# Altium schematic sheet TitlePage.SchDoc: Renesas Public Template
size Tabloid; Author: M. Merrill; Company Name: Renesas Electronics America; Organization: Renesas Electronics; Address1: 915 Murphy Ranch Road; Address2: Milpitas, CA  95035; DocumentNumber: 1; Revision: 01; SheetNumber: 1; SheetTotal: 2; CompanyURL: www.renesas.com; PageSetup: Record=PageOptions|CenterHorizontal=True|CenterVertical=True|PrintScale=1.00|XCorrection=1.00|YCorrection=1.00|PrintKind=1|BorderSize=5000000|LeftOffset=0|BottomOffset=0|Orientation=2|PaperLength=1000|PaperWidth=1000|Scale=100|PaperSource=7|PrintQuality=-4|MediaType=1|DitherType=10|PaperKind=A5 148x210mm|PrintScaleMode=1
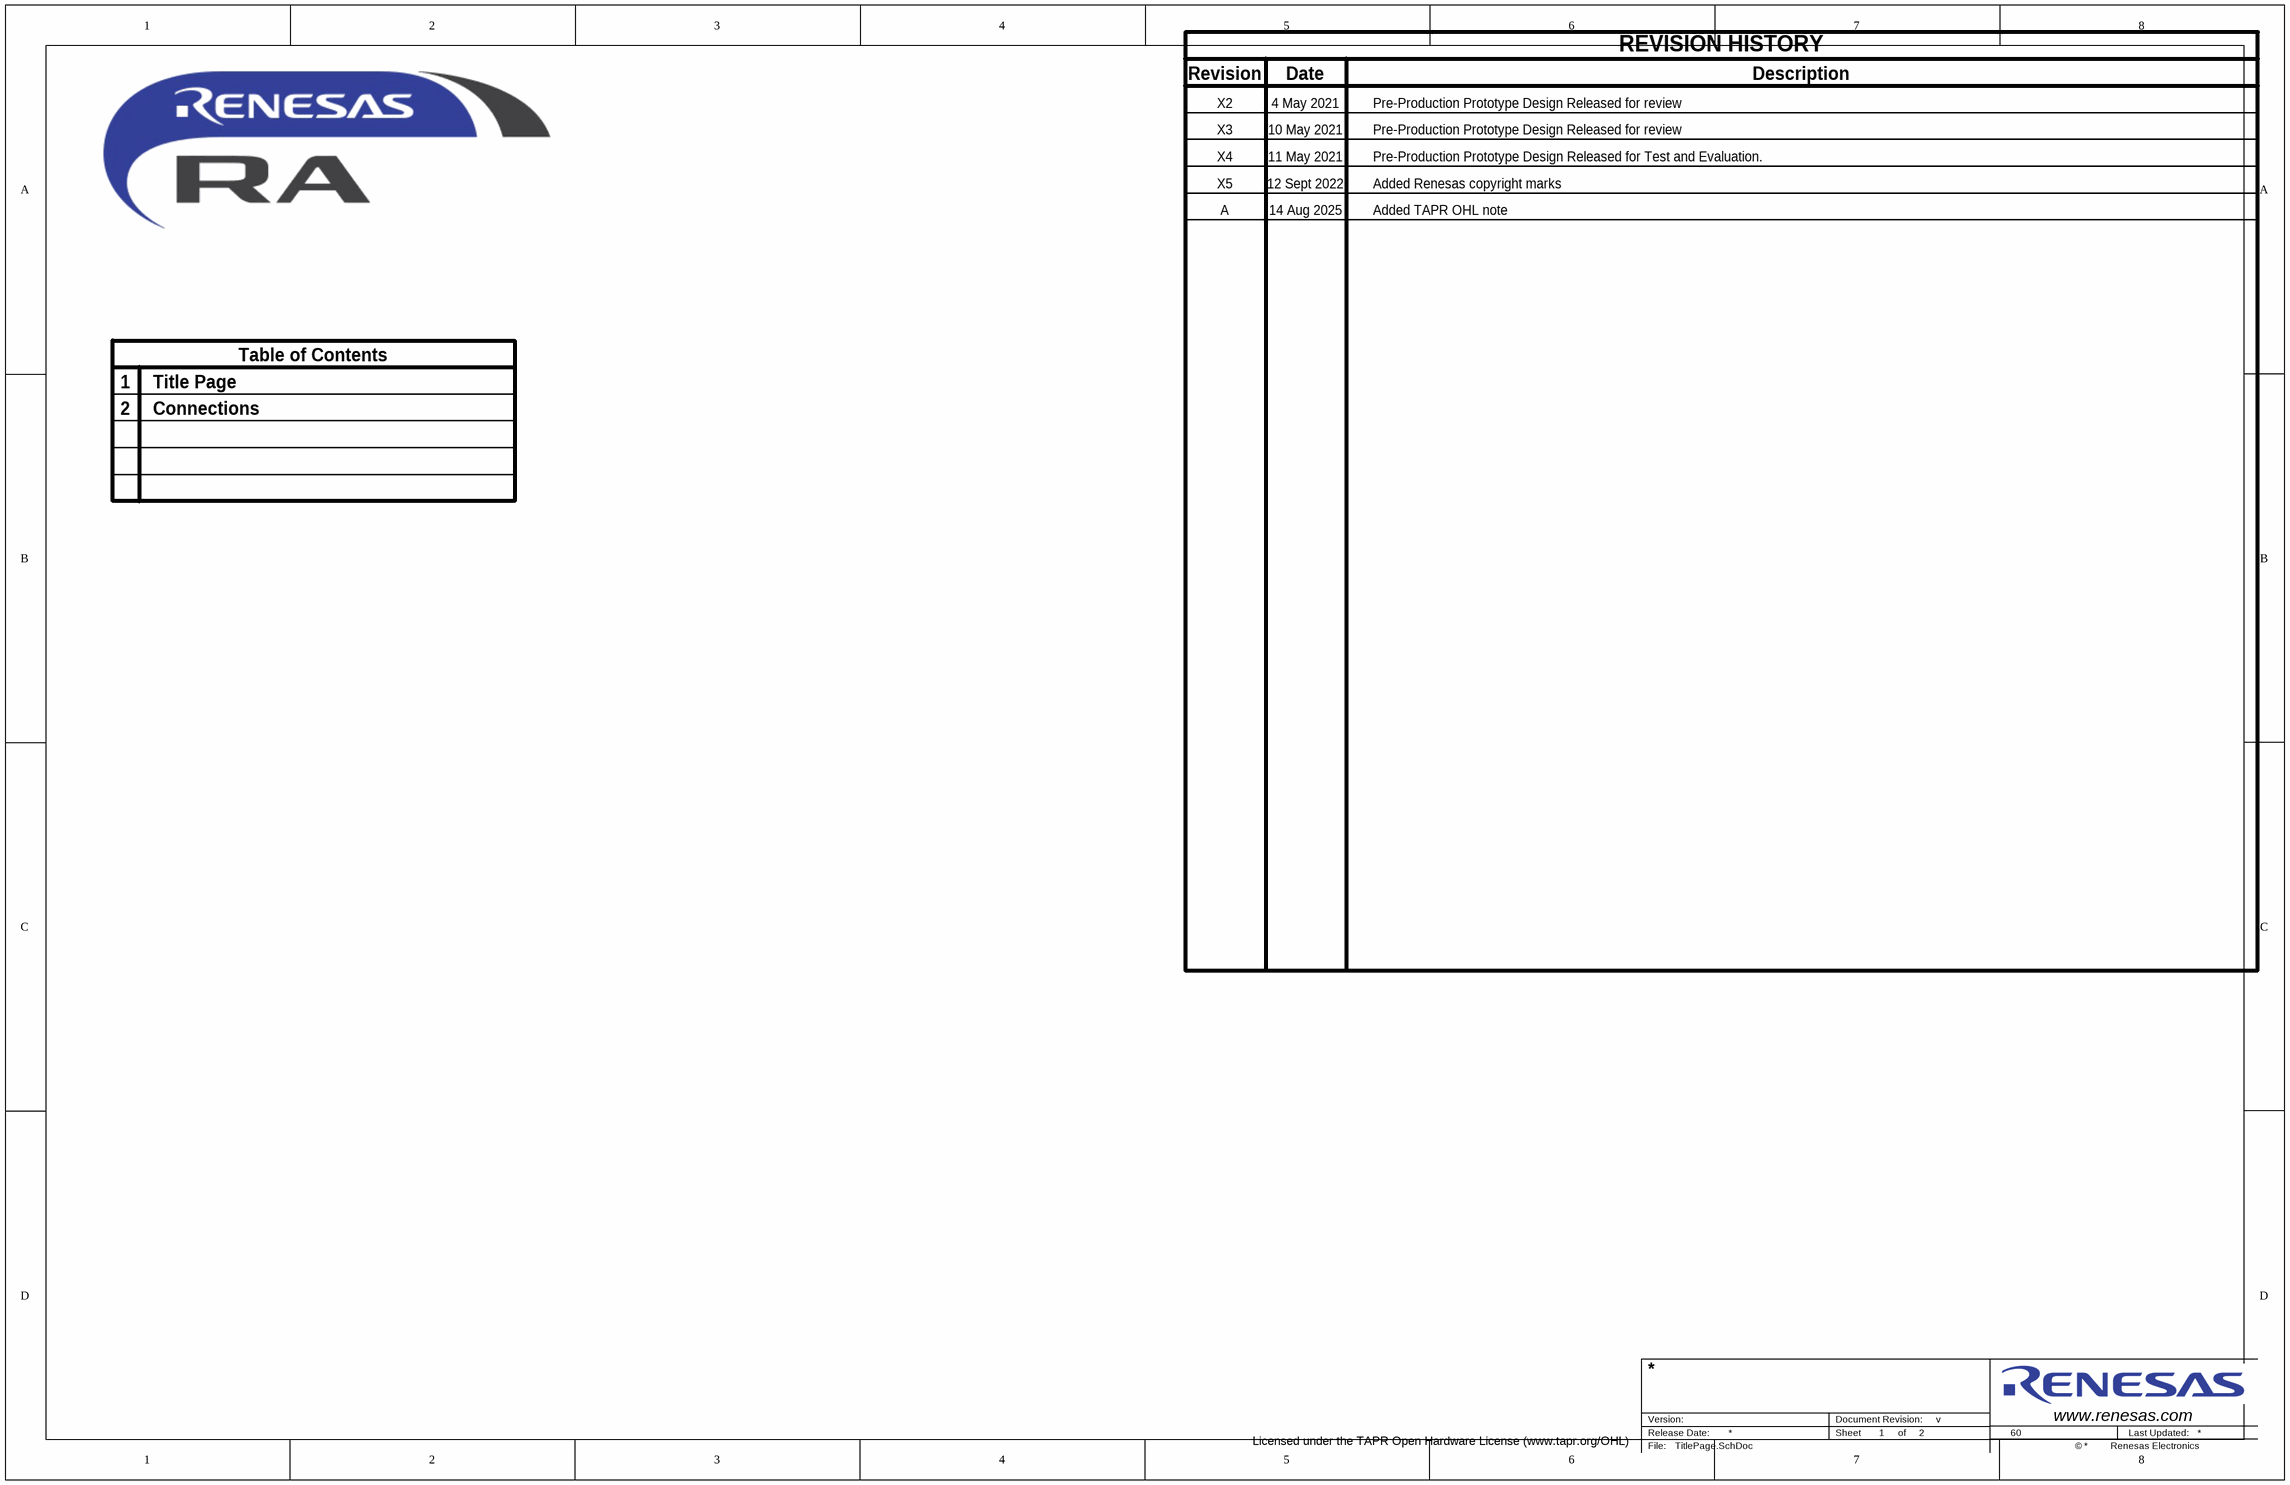
[diagram p0: TitlePage.SchDoc]

## Notes on the sheet
- Revision
- Date
- REVISION HISTORY
- Description
- X2
- X3
- X4
- 4 May 2021
- 10 May 2021
- 11 May 2021
- Pre-Production Prototype Design Released for review
- Pre-Production Prototype Design Released for Test and Evaluation.
- X5
- A
- 12 Sept 2022
- 14 Aug 2025
- Added Renesas copyright marks
- Added TAPR OHL note
- Table of Contents
- 1
- 2
- Title Page
- Connections
- Licensed under the TAPR Open Hardware License (www.tapr.org/OHL)
- Version:
- Release Date:
- Document Revision:
- Sheet
- of
- v
- 60
- www.renesas.com <http://www.renesas.com>
- Last Updated:
- File:
- ©
- Renesas Electronics